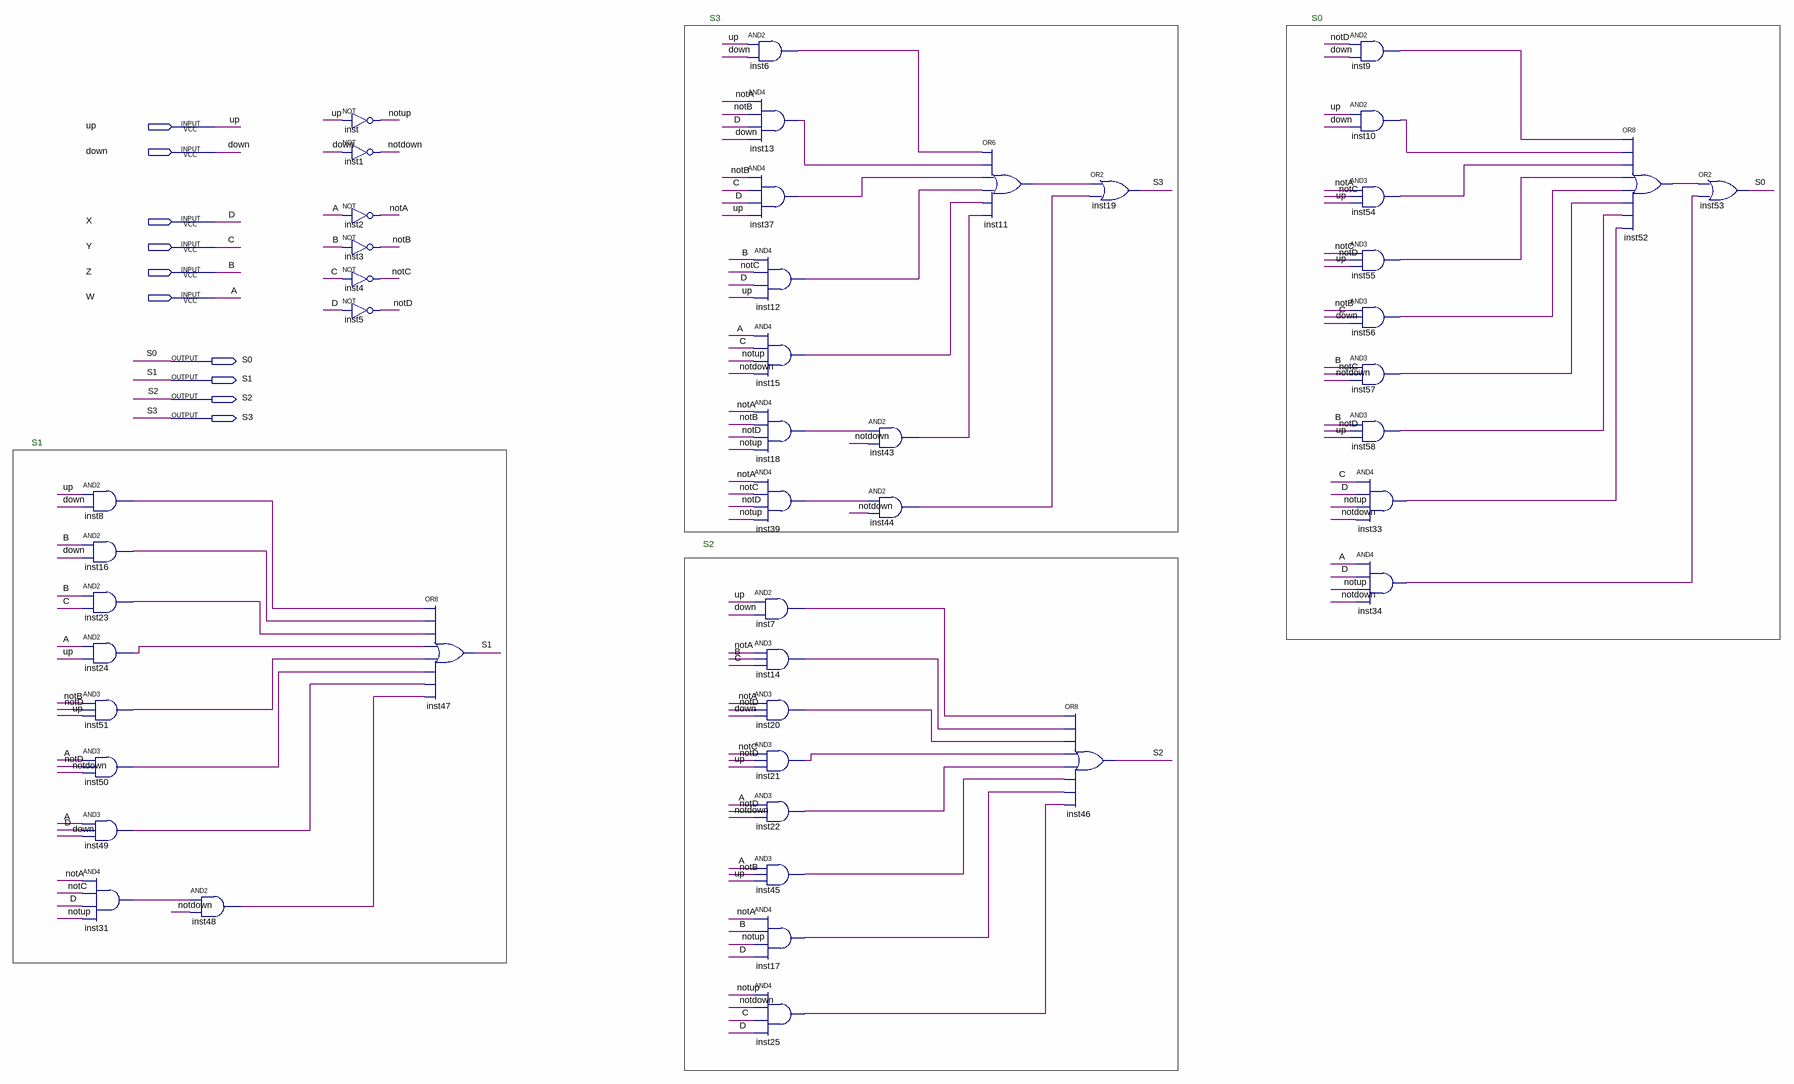
[diagram p0: schematic sheet]
// Quartus schematic saida.bdf as structural Verilog: 47 symbols, 10 pins
module saida (
  input  up,
  input  down,
  input  X,
  input  Y,
  input  Z,
  input  W,
  output S0,
  output S1,
  output S2,
  output S3
);

  wire inst6_out, inst7_out, inst8_out, inst9_out, inst10_out, inst11_out, inst12_out, inst13_out,
       inst14_out, inst15_out, inst16_out, inst17_out, inst18_out, inst20_out, inst21_out, inst22_out,
       inst23_out, inst24_out, inst25_out, inst31_out, inst33_out, inst34_out, inst37_out, inst39_out,
       inst43_out, inst44_out, inst45_out, inst48_out, inst49_out, inst50_out, inst51_out, inst52_out,
       inst54_out, inst55_out, inst56_out, inst57_out, inst58_out, notA, notB, notC, notD, notdown, notup;

  and inst8 (inst8_out, up, down);
  and inst16 (inst16_out, Z, down);
  and inst23 (inst23_out, Z, Y);
  and inst24 (inst24_out, W, up);
  and inst51 (inst51_out, notB, notD, up);
  and inst50 (inst50_out, W, notD, notdown);
  and inst49 (inst49_out, W, X, down);
  and inst31 (inst31_out, notA, notC, X, notup);
  and inst48 (inst48_out, inst31_out, notdown);
  not inst (notup, up);
  not inst1 (notdown, down);
  not inst2 (notA, W);
  not inst3 (notB, Z);
  not inst4 (notC, Y);
  not inst5 (notD, X);
  or inst47 (S1, inst8_out, inst16_out, inst23_out, inst24_out, inst51_out, inst50_out, inst49_out, inst48_out);
  and inst6 (inst6_out, up, down);
  and inst13 (inst13_out, notA, notB, X, down);
  and inst37 (inst37_out, notB, Y, X, up);
  and inst12 (inst12_out, Z, notC, X, up);
  and inst15 (inst15_out, W, Y, notup, notdown);
  and inst18 (inst18_out, notA, notB, notD, notup);
  and inst39 (inst39_out, notA, notC, notD, notup);
  and inst7 (inst7_out, up, down);
  and inst14 (inst14_out, notA, Z, Y);
  and inst20 (inst20_out, notA, notD, down);
  and inst21 (inst21_out, notC, notD, up);
  and inst22 (inst22_out, W, notD, notdown);
  and inst45 (inst45_out, W, notB, up);
  and inst17 (inst17_out, notA, Z, notup, X);
  and inst25 (inst25_out, notup, notdown, Y, X);
  and inst43 (inst43_out, inst18_out, notdown);
  and inst44 (inst44_out, inst39_out, notdown);
  or inst11 (inst11_out, inst6_out, inst13_out, inst37_out, inst12_out, inst15_out, inst43_out);
  or inst19 (S3, inst11_out, inst44_out);
  or inst46 (S2, inst7_out, inst14_out, inst20_out, inst21_out, inst22_out, inst45_out, inst17_out, inst25_out);
  and inst9 (inst9_out, notD, down);
  and inst10 (inst10_out, up, down);
  and inst54 (inst54_out, notA, notC, up);
  and inst55 (inst55_out, notC, notD, up);
  and inst56 (inst56_out, notB, Y, down);
  and inst57 (inst57_out, Z, notC, notdown);
  and inst58 (inst58_out, Z, notD, up);
  and inst33 (inst33_out, Y, X, notup, notdown);
  and inst34 (inst34_out, W, X, notup, notdown);
  or inst52 (inst52_out, inst9_out, inst10_out, inst54_out, inst55_out, inst56_out, inst57_out, inst58_out, inst33_out);
  or inst53 (S0, inst52_out, inst34_out);

  // Other names for the same wires on the sheet: A = W; B = Z; C = Y; D = X

  // Notes on the sheet:
  //   S3
  //   S0
  //   S1
  //   S2
endmodule
